# Altium project RS485_GPIO.PrjPcb (part 1 of 2)
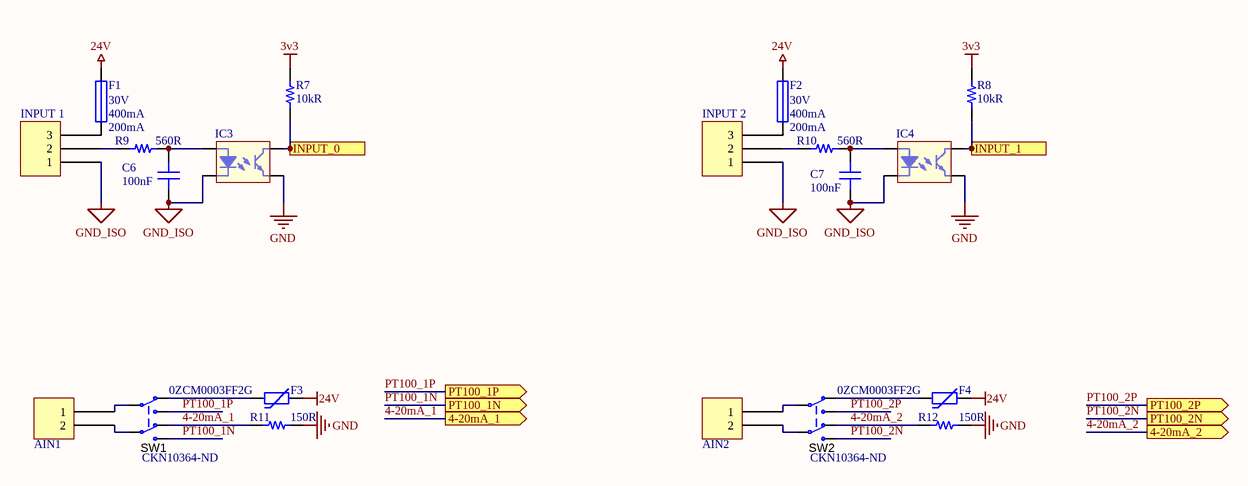
[diagram p0: Inputs.SchDoc]
4 sheets, 77 parts. Net scope: flat (ports and power ports of the same name join across sheets).
Board file: RS485_GPIO.PcbDoc
Sheets:
  Inputs.SchDoc
  Outputs.SchDoc
  4-20mA.SchDoc
  PT100.SchDoc

## Sheet Inputs.SchDoc: Isolated Input
size A4; Revision: 1; SheetNumber: 3; SheetTotal: 7; SheetSize: A4

### Parts
AIN1  2 Pin  [TE 282834-2]  (value not drawn)
AIN2  2 Pin  [TE 282834-2]  (value not drawn)
C6  100nF  [CAP 0603/1608]
C7  100nF  [CAP 0603/1608]
F1  Hold Current: 200mA  Max Voltage Rating (DC): 30V  Trip Current: 400mA  [L_1812]  (hidden comment: 0ZCJ0020FF2E)
F2  Hold Current: 200mA  Max Voltage Rating (DC): 30V  Trip Current: 400mA  [L_1812]  (hidden comment: 0ZCJ0020FF2E)
F3  0ZCM0003FF2G  [NTC 0603_1608]
F4  0ZCM0003FF2G  [NTC 0603_1608]
IC3  EL3H7(B)(TA)-VG  [EL3H7-VG]  (value not drawn)
IC4  EL3H7(B)(TA)-VG  [EL3H7-VG]  (value not drawn)
INPUT_1  (no value)  [TE 282834-3]
INPUT_2  (no value)  [TE 282834-3]
R7  10kR  [RES 0603/1608]
R8  10kR  [RES 0603/1608]
R9  560R  [RES 0603/1608]
R10  560R  [RES 0603/1608]
R11  150R  [RES 0603/1608]
R12  150R  [RES 0603/1608]
SW1  Supplier Part Number 1: CKN10364-ND  [SK-22D01-MG 5 NS]  (hidden comment: SK22D01MG5NS)
SW2  Supplier Part Number 1: CKN10364-ND  [SK-22D01-MG 5 NS]  (hidden comment: SK22D01MG5NS)

### Ports
4-20mA_1 (out), 4-20mA_2 (out), INPUT_0 (out), INPUT_1 (out), PT100_1N (out), PT100_1P (out), PT100_2N (out), PT100_2P (out)

### Nets
3v3: R7.2 R8.2
24V: F1.2 F2.2 F3.2 F4.2
GND: IC3.3 IC4.3 R11.2 R12.2
GND_ISO: C6.1 C7.1 IC3.2 IC4.2 INPUT_1.1 INPUT_2.1
4-20mA_1: R11.1 SW1.3 ; port 4-20mA_1
4-20mA_2: R12.1 SW2.3 ; port 4-20mA_2
PT100_1N: SW1.1 ; port PT100_1N
PT100_1P: SW1.4 ; port PT100_1P
PT100_2N: SW2.1 ; port PT100_2N
PT100_2P: SW2.4 ; port PT100_2P
NetAIN1_1: AIN1.1 SW1.5
NetAIN1_2: AIN1.2 SW1.2
NetAIN2_1: AIN2.1 SW2.5
NetAIN2_2: AIN2.2 SW2.2
NetC6_2: C6.2 IC3.1 R9.2
NetC7_2: C7.2 IC4.1 R10.2
NetF1_1: F1.1 INPUT_1.3
NetF2_1: F2.1 INPUT_2.3
NetF3_1: F3.1 SW1.6
NetF4_1: F4.1 SW2.6
NetIC3_4: IC3.4 R7.1 ; port INPUT_0
NetIC4_4: IC4.4 R8.1 ; port INPUT_1
NetINPUT_1_2: INPUT_1.2 R9.1
NetINPUT_2_2: INPUT_2.2 R10.1

### Notes on the sheet
- Title:
- Size:
- Project:
- Revision:
- Sheet
- of
- Date:
- YıLDıZ IoT
- Elperek Mahallesi
- Saray Sokak, No:12
- SAKARYA / TURKEY
- File:

### Library data of the parts
AIN1 AIN2 = 2 Pin: Manufacturer: TE Connectivity; Manufacturer Part Number: 282834-2; Plating: Brass,Steel; Max Supply Voltage (AC): 150V; Number of Contacts: 2; Closed End: No (Without); Max Current Rating: 10A; Connector Type: Receptacle; Screwless Terminal Block: Yes (With); Gender: Male; Number of Levels: 1; Tail Length: 3.4mm; Wire Gauge (Max): 30AWG; Pitch: 2.54mm; Thread Size: M1.6; Approvals: UL; Supplier 1: Digi-Key; Supplier Part Number 1: A98333-ND; Stock 1: 19973; Pricing 1: 1 = 0,89000, 10 = 0,62600, 25 = 0,58360, 50 = 0,52980, 100 = 0,52740, 250 = 0,44536, 500 = 0,42192, 1000 = 0,37504, 5000 = 0,35160 (USD); RoHS: Yes; Mount: Through Hole; Material: Nylon; Housing Color: Green; Contact Plating: Tin; Contact Material: Brass; Color: Green; Housing Material: Polyamide; Min Operating Temperature: -40°C; Max Operating Temperature: 105°C; Number of Circuits: 2; Interlock: No (Without); Screw Flange: No (Without); Side Stackable: Yes (With); Orientation: Straight; Number of Rows: 1; Max Voltage Rating (AC): 150V; Number of Poles: 2; Current Rating: 10A; Voltage Rating: 150V; Package Quantity: 300; Packaging: Bulk; Number of Positions: 2; Termination: Solder; Number of Positions Per Level: 2; Current: 10A; Voltage: 150V; Length: 5.54mm; Depth: 6.5mm; Wire Gauge (Min): 30AWG; Width: 6.5mm; Wire/Cable Gauge: 30AWG; Radiation Hardening: No; ELV: Compliant; Lead Free: Lead Free; REACH SVHC: Unknown; Flammability Rating: UL94 V-0; ComponentLink1URL: https://datasheet.ciiva.com/11758/0900766b80e7dc96-11758675.pdf?src-supplier=RSComponents; ComponentLink1Description: https://datasheet.ciiva.com/11758/0900766b80e7dc96-11758675.pdf?src-supplier=RSComponents; ComponentLink2URL: https://datasheet.ciiva.com/16386/282834-2-16386363.pdf?src-supplier=Future+Electronics; ComponentLink2Description: https://datasheet.ciiva.com/16386/282834-2-16386363.pdf?src-supplier=Future+Electronics; ComponentLink3URL: https://datasheet.ciiva.com/14609/70086732-14609670.pdf?src-supplier=Allied+Electronics; ComponentLink3Description: https://datasheet.ciiva.com/14609/70086732-14609670.pdf?src-supplier=Allied+Electronics; ComponentLink4URL: https://datasheet.ciiva.com/15169/getdatasheetpartid-155864-15169558.pdf?src-supplier=Verical; ComponentLink4Description: https://datasheet.ciiva.com/15169/getdatasheetpartid-155864-15169558.pdf?src-supplier=Verical; ComponentLink5URL: https://datasheet.ciiva.com/3141/eng-cs-1308389-eurostyle-terminal-blocks-0607-3141115.pdf?src-supplier=Avnet; ComponentLink5Description: https://datasheet.ciiva.com/3141/eng-cs-1308389-eurostyle-terminal-blocks-0607-3141115.pdf?src-supplier=Avnet; ComponentLink6URL: https://datasheet.ciiva.com/823/eng-cd-282834-c1-823453.pdf?src-supplier=Digi-Key; ComponentLink6Description: https://datasheet.ciiva.com/823/eng-cd-282834-c1-823453.pdf?src-supplier=Digi-Key; ComponentLink7URL: https://datasheet.ciiva.com/16676/eng-cs-1308389-eurostyle-terminal-blocks-0607-16676126.pdf?src-supplier=Avnet+Europe; ComponentLink7Description: https://datasheet.ciiva.com/16676/eng-cs-1308389-eurostyle-terminal-blocks-0607-16676126.pdf?src-supplier=Avnet+Europe; ComponentLink8URL: https://datasheet.ciiva.com/30166/eng-cs-1308389-eurostyle-terminal-blocks-0607-30166974.pdf?src-supplier=Onlinecomponents.com; ComponentLink8Description: https://datasheet.ciiva.com/30166/eng-cs-1308389-eurostyle-terminal-blocks-0607-30166974.pdf?src-supplier=Onlinecomponents.com
C6 C7 = Capacitor - Ceramic: Ceramic, SMT Capacitor; Manufacturer: Samsung; Manufacturer Part Number: CL10B104JB8NNNC; Tolerance: 5%; Voltage Rating: 50V; Dielectric: X7R; Supplier 1: Digi-Key; Supplier Part Number 1: 1276-1033-1-ND; Stock 1: 223594; Pricing 1: 1 = 0,10000, 10 = 0,05300, 100 = 0,02350, 500 = 0,01680, 1000 = 0,01320 (USD); RoHS: Yes; Mount: Surface Mount; Case/Package: 0603; Case Code (Metric): 1608; Case Code (Imperial): 0603; Material: Ceramic; Contact Plating: Tin; Min Operating Temperature: -55°C; Max Operating Temperature: 125°C; Packaging: Tape and Reel; Package Quantity: 1; Capacitance: 100nF; Voltage: 50V; Length: 1.6mm; Height: 0.8mm; Width: 0.031inch; Thickness: 0.035inch; Depth: 0.8mm; Radiation Hardening: No; ComponentLink1URL: https://media.digikey.com/pdf/Data%20Sheets/Samsung%20PDFs/CL_Series_MLCC_ds.pdf?src-supplier=Digi-Key; ComponentLink1Description: https://media.digikey.com/pdf/Data%20Sheets/Samsung%20PDFs/CL_Series_MLCC_ds.pdf?src-supplier=Digi-Key; ComponentLink2URL: https://www.verical.com/server-webapp/html/getDatasheet?partID=359321&src-supplier=Verical; ComponentLink2Description: https://www.verical.com/server-webapp/html/getDatasheet?partID=359321&src-supplier=Verical; ComponentLink3URL: http://www1.futureelectronics.com/doc/SAMSUNG/CL10B104JB8NNNC.pdf?src-supplier=Future+Electronics; ComponentLink3Description: http://www1.futureelectronics.com/doc/SAMSUNG/CL10B104JB8NNNC.pdf?src-supplier=Future+Electronics; ComponentLink4URL: https://produktinfo.conrad.com/datenblaetter/450000-474999/456613-da-01-en-VS_KONDENSATOR_0603.pdf?src-supplier=Conrad; ComponentLink4Description: https://produktinfo.conrad.com/datenblaetter/450000-474999/456613-da-01-en-VS_KONDENSATOR_0603.pdf?src-supplier=Conrad
F1 F2 = Fuse 1: Fuse; Manufacturer: Bel; Max Current Rating: 10A; Power Dissipation: 400mW; Time to Trip: 0.1s; Approvals: TUV,UL; ComponentLink2Description: SMD; ComponentLink3Description: ESIMF110/16-2; Supplier 1: Digi-Key; Supplier Part Number 1: 507-1797-1-ND; Manufacturer Part Number: 0ZCJ0020FF2E; Stock 1: 381173; Pricing 1: 1 = 0,13000, 5 = 0,13000, 10 = 0,12500, 50 = 0,11140, 100 = 0,10370, 250 = 0,09216, 500 = 0,07680, 1000 = 0,07296 (USD); RoHS: Yes; Mount: Surface Mount; Case/Package: 1206; Case Code (Metric): 3216; Case Code (Imperial): 1206; Contact Plating: Matte,Tin; Number of Terminals: 2; Min Operating Temperature: -40°C; Max Operating Temperature: 85°C; Package Quantity: 3000; Packaging: Cut Tape; Lead Free: Lead Free; ComponentLink1URL: https://www.belfuse.com/resources/CircuitProtection/datasheets/0ZCJ%20Nov2016.pdf; ComponentLink1Description: https://www.belfuse.com/resources/CircuitProtection/datasheets/0ZCJ%20Nov2016.pdf; Price: 0,13
F3 F4 = ERT-J1VK102JM: THERM NTC 0603 (FOR AUTOMOTIVE); Manufacturer: Bel; ComponentLink1Description: Datasheet; ComponentLink1URL: https://industrial.panasonic.com/cdbs/www-data/pdf/AUA0000/AUA0000C11.pdf; ComponentLink2Description: DigiKey Link; ComponentLink2URL: http://digikey.com/product-detail/en/panasonic-electronic-components/ERT-J1VK102JM/P123690DKR-ND/9351505; Supplier 1: Digi-Key; Supplier Part Number 1: 507-0ZCM0003FF2GCT-ND; Manufacturer Part Number: 0ZCM0003FF2G; Stock 1: 12; Pricing 1: 1 = 0,16000, 5 = 0,16000, 10 = 0,15200, 50 = 0,13580, 100 = 0,12640, 250 = 0,11232, 500 = 0,09360, 1000 = 0,08892 (USD); RoHS: No
IC3 IC4 = Optoisolator: Manufacturer: Everlight; Number of Channels: 1; Collector Emitter Voltage (VCEO): 80V; Max Power Dissipation: 200mW; Forward Current: 50mA; Forward Voltage: 1.4V; Reverse Breakdown Voltage: 6V; Rise Time: 18000ns; Collector Emitter Saturation Voltage: 200mV; Isolation Voltage: 3.75kV; Current Transfer Ratio: 260%; Approvals: UL; Supplier 1: Digi-Key; Supplier Part Number 1: 1080-1197-1-ND; Manufacturer Part Number: EL3H7(B)(TA)-VG; Stock 1: 29823; Pricing 1: 1 = 0,50000, 10 = 0,35500, 100 = 0,20730, 500 = 0,14212, 1000 = 0,11844, 2500 = 0,10660 (USD); RoHS: Yes; Mount: Surface Mount; Case/Package: SSOP; Number of Pins: 4; Min Operating Temperature: -55°C; Max Operating Temperature: 125°C; Packaging: Tape and Reel; Package Quantity: 1; Max Output Voltage: 80V; Output Current per Channel: 50mA; Max Input Current: 50mA; Max Collector Current: 50mA; Fall Time: 18000ns; Number of Elements: 1; Power Dissipation: 200mW; Collector Emitter Breakdown Voltage: 80V; Radiation Hardening: No; Lead Free: Lead Free; ComponentLink1URL: https://datasheet.ciiva.com/2086/el3h7-g-series-2086501.pdf?src-supplier=Digi-Key; ComponentLink1Description: https://datasheet.ciiva.com/2086/el3h7-g-series-2086501.pdf?src-supplier=Digi-Key; ComponentLink2URL: https://datasheet.ciiva.com/2086/el3h7-g-series-2086502.pdf?src-supplier=Digi-Key; ComponentLink2Description: https://datasheet.ciiva.com/2086/el3h7-g-series-2086502.pdf?src-supplier=Digi-Key; ComponentLink3URL: https://datasheet.ciiva.com/2086/el3h7-g-series-2086503.pdf?src-supplier=Digi-Key; ComponentLink3Description: https://datasheet.ciiva.com/2086/el3h7-g-series-2086503.pdf?src-supplier=Digi-Key; ComponentLink4URL: https://datasheet.ciiva.com/15209/getdatasheetpartid-416716-15209115.pdf?src-supplier=Verical; ComponentLink4Description: https://datasheet.ciiva.com/15209/getdatasheetpartid-416716-15209115.pdf?src-supplier=Verical
INPUT_1 INPUT_2 = 3 Pin: TERM BLOCK HDR 3POS R/A 3.81MM; Manufacturer: On-Shore Technology; Manufacturer Part Number: OSTVN03A150; Plating: Brass,Steel; Number of Levels: 1; Number of Positions Per Level: 3; Current: 6A; Voltage: 125V; Pitch: 0.1inch; Wire Gauge (Max): 30AWG; Wire Gauge (Min): 20AWG; ComponentLink1Description: Datasheet; ComponentLink1URL: http://portal.fciconnect.com/Comergent//fci/drawing/20020110.pdf; ComponentLink2Description: Digi-Key Listing; ComponentLink2URL: http://www.digikey.ca/product-detail/en/20020110-D031A01LF/609-3820-ND/2261261; Supplier 1: Digi-Key; Supplier Part Number 1: ED10562-ND; Stock 1: 6258; Pricing 1: 1 = 1,03000, 10 = 0,72600, 25 = 0,67720, 50 = 0,61480, 100 = 0,61200, 250 = 0,51680, 500 = 0,48960, 1000 = 0,43520, 5000 = 0,35360 (USD); RoHS: Yes; Mount: Through Hole; Number of Pins: 3; Housing Material: Thermoplastic; Color: Green; Contact Plating: Brass; Min Operating Temperature: -30°C; Max Operating Temperature: 105°C; Termination: Screw; Packaging: Bulk; ComponentLink3URL: https://datasheet.ciiva.com/825/ostvnxxa150-825196.pdf?src-supplier=Digi-Key; ComponentLink3Description: https://datasheet.ciiva.com/825/ostvnxxa150-825196.pdf?src-supplier=Digi-Key
R7 R8 = Resistor_Chip: Ceramic, SMT Capacitor; Manufacturer: Stackpole Electronics; Manufacturer Part Number: RNCP0603FTD10K0; Tolerance: 1%; Max Power Dissipation: 125mW; Temperature Coefficient: 100ppm/°C; Supplier 1: Digi-Key; Supplier Part Number 1: RNCP0603FTD10K0CT-ND; Stock 1: 183083; Pricing 1: 1 = 0,10000, 10 = 0,06700, 100 = 0,02730, 1000 = 0,01224, 2500 = 0,01063 (USD); RoHS: Yes; Mount: Surface Mount; Case/Package: 0603; Case Code (Metric): 1608; Case Code (Imperial): 0603; Contact Plating: Matte,Tin; Min Operating Temperature: -55°C; Max Operating Temperature: 155°C; Packaging: Tape and Reel; Resistance: 10kR; Composition: Thin Film; Number of Terminations: 2; Features: Anti-Sulfur,Moisture Resistant; Length: 0.059inch; Height: 0.02inch; Width: 0.031inch; Radiation Hardening: No; Lead Free: Lead Free
R9 R10 = Resistor_Chip: Ceramic, SMT Capacitor; Manufacturer: Rohm; Manufacturer Part Number: ESR03EZPJ561; Tolerance: 5%; Temperature Coefficient: 200ppm/°C; Max Power Dissipation: 250mW; Supplier 1: Digi-Key; Supplier Part Number 1: RHM560DCT-ND; Stock 1: 14494; Pricing 1: 1 = 0,10000, 10 = 0,08700, 100 = 0,03330, 1000 = 0,01464, 2500 = 0,01264 (USD); RoHS: Yes; Case/Package: 0603; Case Code (Metric): 1608; Case Code (Imperial): 0603; Min Operating Temperature: -55°C; Max Operating Temperature: 155°C; Package Quantity: 1; Resistance: 560R; Packaging: Tape and Reel; Composition: Thick Film; Number of Terminations: 2; Features: Automotive AEC-Q200; Length: 0.063inch; Height: 0.022inch; Width: 0.031inch; ComponentLink1URL: http://www.rohm.com/web/global/datasheet/ESR01MZPF/esr-e; ComponentLink1Description: http://www.rohm.com/web/global/datasheet/ESR01MZPF/esr-e; ComponentLink2URL: https://www.rohm.com/datasheet/ESR01MZPF/esr-e; ComponentLink2Description: https://www.rohm.com/datasheet/ESR01MZPF/esr-e
R11 R12 = Resistor_Chip: Ceramic, SMT Capacitor; Manufacturer: Yageo; Manufacturer Part Number: RC0603FR-07150RL; Temperature Coefficient: 100ppm/°C; Tolerance: 1%; Voltage Rating (DC): 50V; Power Rating: 100mW; Supplier 1: Digi-Key; Supplier Part Number 1: 311-150HRCT-ND; Stock 1: 2591507; Pricing 1: 1 = 0,10000, 10 = 0,02300, 100 = 0,00940, 1000 = 0,00421, 2500 = 0,00366 (USD); RoHS: Yes; Case/Package: 0603; Number of Pins: 2; Case Code (Imperial): 0603; Case Code (Metric): 1608; Min Operating Temperature: -55°C; Max Operating Temperature: 155°C; Resistance: 150R; Packaging: Tape and Reel; Composition: Thick Film; Termination: SMD/SMT; Military Standard: Not; Voltage Rating: 50V; Package Quantity: 5000; Length: 1.6mm; Height: 0.45mm; Width: 0.8mm; Depth: 0.8mm; Lead Free: Lead Free; REACH SVHC: No SVHC; ComponentLink1URL: https://datasheet.ciiva.com/46440/1868787-46440893.pdf?src-supplier=Element14; ComponentLink1Description: https://datasheet.ciiva.com/46440/1868787-46440893.pdf?src-supplier=Element14; ComponentLink2URL: https://datasheet.ciiva.com/12555/rc0603-272842-12555301.pdf?src-supplier=Mouser; ComponentLink2Description: https://datasheet.ciiva.com/12555/rc0603-272842-12555301.pdf?src-supplier=Mouser; ComponentLink3URL: https://datasheet.ciiva.com/46412/443971-46412844.pdf?src-supplier=Element14; ComponentLink3Description: https://datasheet.ciiva.com/46412/443971-46412844.pdf?src-supplier=Element14
SW1 SW2 = DPDT Switch: Switch THD right-angle toggle DPDT; Manufacturer: ITT C&K; Actuator Material: PBT,Polybutylene; Actuator Type: Standard; Electrical Life: 10000Cycles; Illumination Type: Non-Illuminated; Current Rating: 300mA; Voltage Rating (DC): 30V; Switch Travel: 2mm; Switch Function: On-On; Actuator Length: 5mm; Supplier 1: Digi-Key; Manufacturer Part Number: SK22D01MG5NS; Stock 1: 4200; Pricing 1: 1 = 0,69000, 10 = 0,66900, 25 = 0,64320, 100 = 0,55820, 250 = 0,50936, 500 = 0,47334, 1000 = 0,42446, 2500 = 0,39874, 5000 = 0,37044 (USD); RoHS: Yes; Mount: Through Hole; Contact Plating: Silver; Termination: PC Pin; Throw Configuration: DPDT; Package Quantity: 1000; Contact Current Rating: 300mA; Packaging: Bulk; ComponentLink1URL: https://datasheet.ciiva.com/5279/sk-22d01-mg-190328-5279988.pdf?src-supplier=Mouser; ComponentLink1Description: https://datasheet.ciiva.com/5279/sk-22d01-mg-190328-5279988.pdf?src-supplier=Mouser; ComponentLink2URL: https://datasheet.ciiva.com/2889/sk-22d01-mg-2889186.pdf?src-supplier=Digi-Key; ComponentLink2Description: https://datasheet.ciiva.com/2889/sk-22d01-mg-2889186.pdf?src-supplier=Digi-Key

## Sheet Outputs.SchDoc: Isolated Output
size A4; Revision: 1; SheetNumber: 4; SheetTotal: 7; SheetSize: A4
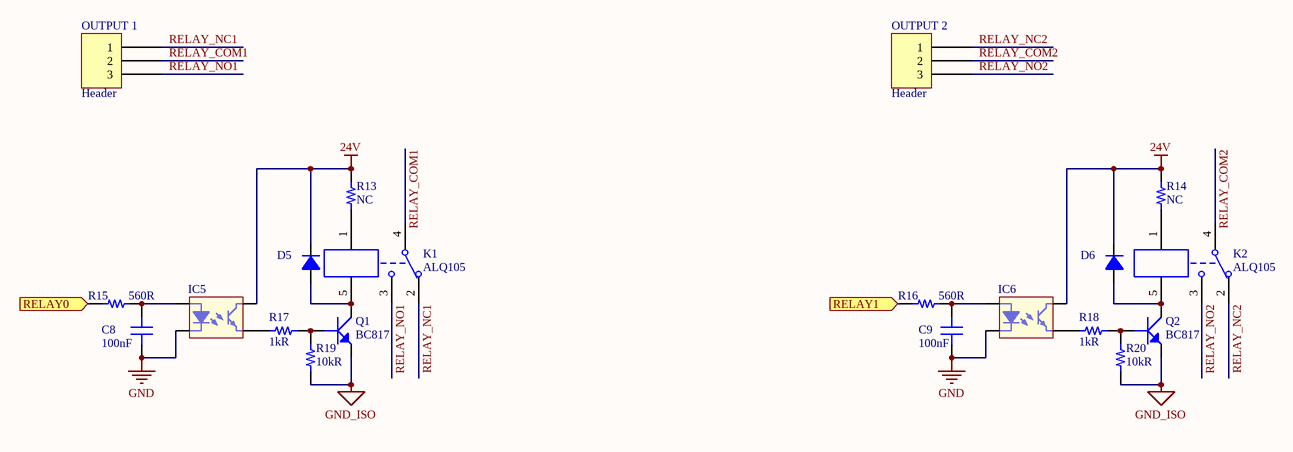
[diagram p1: Outputs.SchDoc]

### Parts
C8  100nF  [CAP 0603/1608]
C9  100nF  [CAP 0603/1608]
D5  1N4148WTR  [sod123]  (value not drawn)
D6  1N4148WTR  [sod123]  (value not drawn)
IC5  EL3H7(B)(TA)-VG  [EL3H7-VG]  (value not drawn)
IC6  EL3H7(B)(TA)-VG  [EL3H7-VG]  (value not drawn)
K1  ALQ105  [ALQ105]
K2  ALQ105  [ALQ105]
OUTPUT_1  Header  [TE 282834-3]
OUTPUT_2  Header  [TE 282834-3]
Q1  BC817  [SOT23-3]  (no BOM)
Q2  BC817  [SOT23-3]  (no BOM)
R13  NC  [RES 0603/1608]  (no BOM)
R14  NC  [RES 0603/1608]  (no BOM)
R15  560R  [RES 0603/1608]
R16  560R  [RES 0603/1608]
R17  1kR  [RES 0603/1608]
R18  1kR  [RES 0603/1608]
R19  10kR  [RES 0603/1608]
R20  10kR  [RES 0603/1608]

### Ports
RELAY0 (in), RELAY1 (in)

### Nets
24V: D5.2 D6.2 IC5.4 IC6.4 R13.2 R14.2
GND: C8.1 C9.1 IC5.2 IC6.2
GND_ISO: Q1.2(E) Q2.2(E) R19.2 R20.2
RELAY_COM1: K1.4(COM) OUTPUT_1.2
RELAY_COM2: K2.4(COM) OUTPUT_2.2
RELAY_NC1: K1.2(NC) OUTPUT_1.1
RELAY_NC2: K2.2(NC) OUTPUT_2.1
RELAY_NO1: K1.3(NO) OUTPUT_1.3
RELAY_NO2: K2.3(NO) OUTPUT_2.3
NetC8_2: C8.2 IC5.1 R15.2
NetC9_2: C9.2 IC6.1 R16.2
NetD5_1: D5.1 K1.5(COIL) Q1.3(C)
NetD6_1: D6.1 K2.5(COIL) Q2.3(C)
NetIC5_3: IC5.3 R17.2
NetIC6_3: IC6.3 R18.2
NetK1_1: K1.1(COIL) R13.1
NetK2_1: K2.1(COIL) R14.1
NetQ1_1: Q1.1(B) R17.1 R19.1
NetQ2_1: Q2.1(B) R18.1 R20.1
NetR15_1: R15.1 ; port RELAY0
NetR16_1: R16.1 ; port RELAY1

### Notes on the sheet
- Title:
- Size:
- Project:
- Revision:
- Sheet
- of
- Date:
- YıLDıZ IoT
- Elperek Mahallesi
- Saray Sokak, No:12
- SAKARYA / TURKEY
- File:

### Library data of the parts
C8 C9 = Capacitor - Ceramic: as C6 on sheet Inputs; Supplier 1: Digi-Key; Supplier Part Number 1: 1276-1033-1-ND; Stock 1: 223594; Pricing 1: 1 = 0,10000, 10 = 0,05300, 100 = 0,02350, 500 = 0,01680, 1000 = 0,01320 (USD); RoHS: Yes; Mount: Surface Mount; Case/Package: 0603; Case Code (Metric): 1608; Case Code (Imperial): 0603; Material: Ceramic; Contact Plating: Tin; Min Operating Temperature: -55°C; Max Operating Temperature: 125°C; Packaging: Tape and Reel; Package Quantity: 1; Capacitance: 100nF; Voltage: 50V; Length: 1.6mm; Height: 0.8mm; Width: 0.031inch; Thickness: 0.035inch; Depth: 0.8mm; Radiation Hardening: No; ComponentLink1URL: https://media.digikey.com/pdf/Data%20Sheets/Samsung%20PDFs/CL_Series_MLCC_ds.pdf?src-supplier=Digi-Key; ComponentLink1Description: https://media.digikey.com/pdf/Data%20Sheets/Samsung%20PDFs/CL_Series_MLCC_ds.pdf?src-supplier=Digi-Key; ComponentLink2URL: https://www.verical.com/server-webapp/html/getDatasheet?partID=359321&src-supplier=Verical; ComponentLink2Description: https://www.verical.com/server-webapp/html/getDatasheet?partID=359321&src-supplier=Verical; ComponentLink3URL: http://www1.futureelectronics.com/doc/SAMSUNG/CL10B104JB8NNNC.pdf?src-supplier=Future+Electronics; ComponentLink3Description: http://www1.futureelectronics.com/doc/SAMSUNG/CL10B104JB8NNNC.pdf?src-supplier=Future+Electronics; ComponentLink4URL: https://produktinfo.conrad.com/datenblaetter/450000-474999/456613-da-01-en-VS_KONDENSATOR_0603.pdf?src-supplier=Conrad; ComponentLink4Description: https://produktinfo.conrad.com/datenblaetter/450000-474999/456613-da-01-en-VS_KONDENSATOR_0603.pdf?src-supplier=Conrad
D5 D6 = Diode: Manufacturer: SMC; Max Reverse Voltage (DC): 75V; Average Rectified Current: 250mA; Reverse Recovery Time: 4ns; ComponentLink1URL: http://www.smc-diodes.com/propdf/1N4148W%20N0571%20REV.D.pdf?src-supplier=Digi-Key; ComponentLink1Description: http://www.smc-diodes.com/propdf/1N4148W%20N0571%20REV.D.pdf?src-supplier=Digi-Key; Supplier 1: Digi-Key; Supplier Part Number 1: 1655-1360-1-ND; Manufacturer Part Number: 1N4148WTR; Stock 1: 8882; Pricing 1: 1 = 0,12000, 10 = 0,11300, 25 = 0,10720, 100 = 0,04710, 250 = 0,04524, 500 = 0,03702, 1000 = 0,02571 (USD); RoHS: No; Mount: Surface Mount; Packaging: Tape and Reel
IC5 IC6 = Optoisolator: as IC3 on sheet Inputs; Supplier 1: Digi-Key; Supplier Part Number 1: 1080-1197-1-ND; Manufacturer Part Number: EL3H7(B)(TA)-VG; Stock 1: 29823; Pricing 1: 1 = 0,50000, 10 = 0,35500, 100 = 0,20730, 500 = 0,14212, 1000 = 0,11844, 2500 = 0,10660 (USD); RoHS: Yes; Mount: Surface Mount; Case/Package: SSOP; Number of Pins: 4; Min Operating Temperature: -55°C; Max Operating Temperature: 125°C; Packaging: Tape and Reel; Package Quantity: 1; Max Output Voltage: 80V; Output Current per Channel: 50mA; Max Input Current: 50mA; Max Collector Current: 50mA; Fall Time: 18000ns; Number of Elements: 1; Power Dissipation: 200mW; Collector Emitter Breakdown Voltage: 80V; Radiation Hardening: No; Lead Free: Lead Free; ComponentLink1URL: https://datasheet.ciiva.com/2086/el3h7-g-series-2086501.pdf?src-supplier=Digi-Key; ComponentLink1Description: https://datasheet.ciiva.com/2086/el3h7-g-series-2086501.pdf?src-supplier=Digi-Key; ComponentLink2URL: https://datasheet.ciiva.com/2086/el3h7-g-series-2086502.pdf?src-supplier=Digi-Key; ComponentLink2Description: https://datasheet.ciiva.com/2086/el3h7-g-series-2086502.pdf?src-supplier=Digi-Key; ComponentLink3URL: https://datasheet.ciiva.com/2086/el3h7-g-series-2086503.pdf?src-supplier=Digi-Key; ComponentLink3Description: https://datasheet.ciiva.com/2086/el3h7-g-series-2086503.pdf?src-supplier=Digi-Key; ComponentLink4URL: https://datasheet.ciiva.com/15209/getdatasheetpartid-416716-15209115.pdf?src-supplier=Verical; ComponentLink4Description: https://datasheet.ciiva.com/15209/getdatasheetpartid-416716-15209115.pdf?src-supplier=Verical
K1 K2 = Relay SPDT: Relay or Contactor; Manufacturer: Panasonic; Coil Voltage (DC): 5V; Coil Type: Non-Latching; Relay Type: General Purpose; Throw Configuration: SPDT; Coil Resistance: 62.5R; Coil Current: 80mA; Operate Time: 20ms; Coil Power: 400mW; Max Voltage Rating (AC): 250V; Contact Current Rating: 10A; Supplier 1: Digi-Key; Supplier Part Number 1: 255-3565-ND; Manufacturer Part Number: ALQ105; Stock 1: 8117; Pricing 1: 1 = 1,22000, 10 = 1,14800, 25 = 1,02000, 50 = 0,96900, 100 = 0,91800, 250 = 0,81600, 500 = 0,76500, 1000 = 0,71400, 5000 = 0,68850 (USD); RoHS: Yes; Number of Pins: 5; Weight: 7g; Contact Material: Silver; Min Operating Temperature: -40°C; Max Operating Temperature: 85°C; Termination: PC Pin; Release Time: 20ms; Package Quantity: 100; Packaging: Carton; Power Rating: 400mW; Power Consumption: 400mW; Voltage Rating (AC): 250V; Length: 20mm; Height: 16mm; Depth: 10mm; Width: 10mm; Lead Free: Lead Free; REACH SVHC: Unknown; ComponentLink1URL: http://www.mouser.com/ds/2/315/lq-catalog-1075796.pdf?src-supplier=Mouser; ComponentLink1Description: http://www.mouser.com/ds/2/315/lq-catalog-1075796.pdf?src-supplier=Mouser; ComponentLink2URL: http://www.farnell.com/datasheets/2245159.pdf?src-supplier=Farnell; ComponentLink2Description: http://www.farnell.com/datasheets/2245159.pdf?src-supplier=Farnell; ComponentLink3URL: http://components.arrow.com/part/dataview/0323_06571492?src-supplier=Arrow+Europe; ComponentLink3Description: http://components.arrow.com/part/dataview/0323_06571492?src-supplier=Arrow+Europe; ComponentLink4URL: http://www.alliedelec.com/m/d/b3e6213128df2023f710f2e9cac83292.pdf?src-supplier=Allied+Electronics; ComponentLink4Description: http://www.alliedelec.com/m/d/b3e6213128df2023f710f2e9cac83292.pdf?src-supplier=Allied+Electronics; ComponentLink5URL: https://media.digikey.com/pdf/Data%20Sheets/Panasonic%20Electric%20Works%20PDFs/ALQ(LQ)Relays_NewProdIntro.pdf?src-supplier=Digi-Key; ComponentLink5Description: https://media.digikey.com/pdf/Data%20Sheets/Panasonic%20Electric%20Works%20PDFs/ALQ(LQ)Relays_NewProdIntro.pdf?src-supplier=Digi-Key; ComponentLink6URL: http://www.farnell.com/datasheets/1972641.pdf?src-supplier=Element14; ComponentLink6Description: http://www.farnell.com/datasheets/1972641.pdf?src-supplier=Element14; ComponentLink7URL: http://www.farnell.com/datasheets/2245159.pdf?src-supplier=Newark; ComponentLink7Description: http://www.farnell.com/datasheets/2245159.pdf?src-supplier=Newark
OUTPUT_1 OUTPUT_2 = 3 Pin: Manufacturer: On-Shore Technology; Manufacturer Part Number: OSTVN03A150; Plating: Brass,Steel; Number of Levels: 1; Number of Positions Per Level: 3; Current: 6A; Voltage: 125V; Pitch: 0.1inch; Wire Gauge (Max): 30AWG; Wire Gauge (Min): 20AWG; Supplier 1: Digi-Key; Supplier Part Number 1: ED10562-ND; Stock 1: 6258; Pricing 1: 1 = 1,03000, 10 = 0,72600, 25 = 0,67720, 50 = 0,61480, 100 = 0,61200, 250 = 0,51680, 500 = 0,48960, 1000 = 0,43520, 5000 = 0,35360 (USD); RoHS: Yes; Mount: Through Hole; Number of Pins: 3; Housing Material: Thermoplastic; Color: Green; Contact Plating: Brass; Min Operating Temperature: -30°C; Max Operating Temperature: 105°C; Termination: Screw; Packaging: Bulk; ComponentLink1URL: https://datasheet.ciiva.com/825/ostvnxxa150-825196.pdf?src-supplier=Digi-Key; ComponentLink1Description: https://datasheet.ciiva.com/825/ostvnxxa150-825196.pdf?src-supplier=Digi-Key
Q1 Q2 = BC817: Transistor, BC817; Manufacturer: ON Semiconductor; Manufacturer Part Number: BC817-16LT1G; Transistor Type: NPN; Vce Saturation (Max) @ Ib, Ic: 700mV @ 50mA, 500mA; Current - Collector Cutoff (Max): 100nA (ICBO); DC Current Gain (hFE) (Min) @ Ic, Vce: 100 @ 100mA, 1V; Frequency - Transition: 100MHz; Supplier 1: Digi-Key; Supplier Part Number 1: BC817-16LT1GOSCT-ND; RoHS: RoHS Compliant; Category: Discrete Semiconductor Products; Stock 1: 46603; Pricing 1: 1=0.13, 10=0.118, 100=0.0642, 500=0.0395, 1000=0.02693 (USD); Packaging: Cut Tape (CT); Part Status: Active; Operating Temperature: -65°C ~ 150°C (TJ); Mounting Type: Surface Mount; Package / Case: TO-236-3, SC-59, SOT-23-3; Supplier Device Package: SOT-23-3 (TO-236); Base Part Number: BC817; ComponentLink1URL: http://www.onsemi.com/pub/Collateral/BC817-16LT1-D.PDF; ComponentLink1Description: http://www.onsemi.com/pub/Collateral/BC817-16LT1-D.PDF; Price: 0,13
R13 R14 = Resistor_Chip: Ceramic, SMT Capacitor; Resistance: NC
R15 R16 = Resistor_Chip: as R9 on sheet Inputs; Supplier 1: Digi-Key; Supplier Part Number 1: RHM560DCT-ND; Stock 1: 14494; Pricing 1: 1 = 0,10000, 10 = 0,08700, 100 = 0,03330, 1000 = 0,01464, 2500 = 0,01264 (USD); RoHS: Yes; Case/Package: 0603; Case Code (Metric): 1608; Case Code (Imperial): 0603; Min Operating Temperature: -55°C; Max Operating Temperature: 155°C; Package Quantity: 1; Resistance: 560R; Packaging: Tape and Reel; Composition: Thick Film; Number of Terminations: 2; Features: Automotive AEC-Q200; Length: 0.063inch; Height: 0.022inch; Width: 0.031inch; ComponentLink1URL: http://www.rohm.com/web/global/datasheet/ESR01MZPF/esr-e; ComponentLink1Description: http://www.rohm.com/web/global/datasheet/ESR01MZPF/esr-e; ComponentLink2URL: https://www.rohm.com/datasheet/ESR01MZPF/esr-e; ComponentLink2Description: https://www.rohm.com/datasheet/ESR01MZPF/esr-e
R17 R18 = Resistor_Chip: Ceramic, SMT Capacitor; Manufacturer: Rohm; Manufacturer Part Number: ESR03EZPJ102; Tolerance: 5%; Temperature Coefficient: 200ppm/°C; Max Power Dissipation: 250mW; Supplier 1: Digi-Key; Supplier Part Number 1: RHM1.0KDCT-ND; Stock 1: 148117; Pricing 1: 1 = 0,10000, 10 = 0,08300, 100 = 0,03180, 1000 = 0,01398, 2500 = 0,01207 (USD); RoHS: Yes; Case/Package: 0603; Case Code (Metric): 1608; Case Code (Imperial): 0603; Min Operating Temperature: -55°C; Max Operating Temperature: 155°C; Resistance: 1kR; Package Quantity: 1; Packaging: Tape and Reel; Composition: Thick Film; Number of Terminations: 2; Features: Automotive AEC-Q200; Length: 0.063inch; Height: 0.022inch; Width: 0.031inch; Lead Free: Lead Free; ComponentLink1URL: https://datasheet.ciiva.com/2469/esr-2469603.pdf?src-supplier=Digi-Key; ComponentLink1Description: https://datasheet.ciiva.com/2469/esr-2469603.pdf?src-supplier=Digi-Key; ComponentLink2URL: https://datasheet.ciiva.com/2469/esr-2469604.pdf?src-supplier=Digi-Key; ComponentLink2Description: https://datasheet.ciiva.com/2469/esr-2469604.pdf?src-supplier=Digi-Key; ComponentLink3URL: https://datasheet.ciiva.com/2469/esr-2469605.pdf?src-supplier=Digi-Key; ComponentLink3Description: https://datasheet.ciiva.com/2469/esr-2469605.pdf?src-supplier=Digi-Key
R19 R20 = Resistor_Chip: as R7 on sheet Inputs; Supplier 1: Digi-Key; Supplier Part Number 1: RNCP0603FTD10K0CT-ND; Stock 1: 183083; Pricing 1: 1 = 0,10000, 10 = 0,06700, 100 = 0,02730, 1000 = 0,01224, 2500 = 0,01063 (USD); RoHS: Yes; Mount: Surface Mount; Case/Package: 0603; Case Code (Metric): 1608; Case Code (Imperial): 0603; Contact Plating: Matte,Tin; Min Operating Temperature: -55°C; Max Operating Temperature: 155°C; Packaging: Tape and Reel; Resistance: 10kR; Composition: Thin Film; Number of Terminations: 2; Features: Anti-Sulfur,Moisture Resistant; Length: 0.059inch; Height: 0.02inch; Width: 0.031inch; Radiation Hardening: No; Lead Free: Lead Free

## Sheet 4-20mA.SchDoc: Isolated 4-20mA
size A4; Revision: 1; SheetNumber: 5; SheetTotal: 7; SheetSize: A4
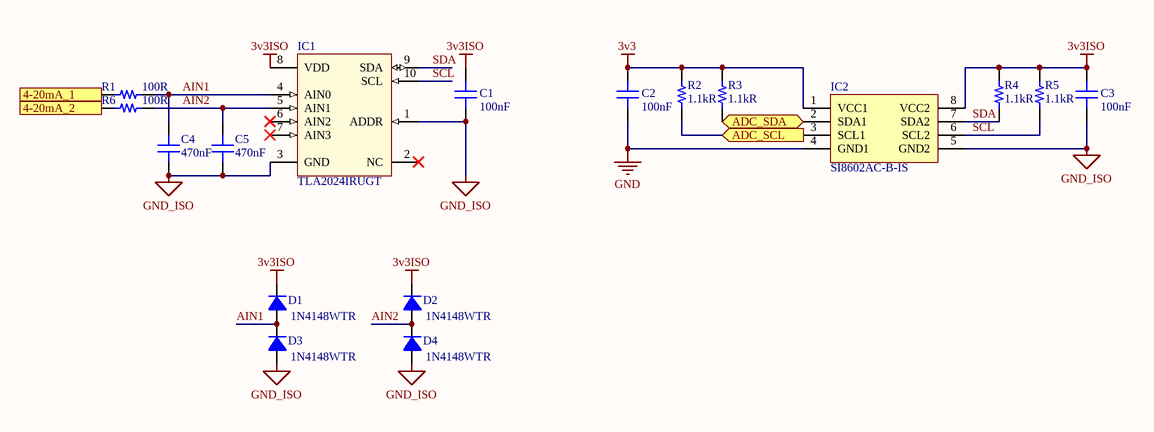
[diagram p2: 4-20mA.SchDoc]

### Parts
C1  100nF  [CAP 0603/1608]
C2  100nF  [CAP 0603/1608]
C3  100nF  [CAP 0603/1608]
C4  470nF  [CAP 0603/1608]
C5  470nF  [CAP 0603/1608]
D1  1N4148WTR  [sod123]
D2  1N4148WTR  [sod123]
D3  1N4148WTR  [sod123]
D4  1N4148WTR  [sod123]
IC1  TLA2024IRUGT  [TI X2QFN-10 2x1.5mm]
IC2  SI8602AC-B-IS  [MICROCHIP SOIC-8 208MIL WIDE]
R1  100R  [RES 0603/1608]
R2  1.1kR  [RES 0603/1608]
R3  1.1kR  [RES 0603/1608]
R4  1.1kR  [RES 0603/1608]
R5  1.1kR  [RES 0603/1608]
R6  100R  [RES 0603/1608]

### Ports
4-20mA_1 (in), 4-20mA_2 (in), ADC_SCL (in), ADC_SDA (bidir)

### Nets
3v3: C2.2 IC2.1(VCC1) R2.1 R3.1
3v3ISO: C1.2 C3.2 D1.2 D2.2 IC1.8(VDD) IC2.8(VCC2) R4.1 R5.1
GND: C2.1 IC2.4(GND1)
GND_ISO: C1.1 C3.1 C4.1 C5.1 D3.1 D4.1 IC1.1(ADDR) IC1.3(GND) IC2.5(GND2)
4-20mA_1: R1.1 ; port 4-20mA_1
4-20mA_2: R6.1 ; port 4-20mA_2
AIN1: C4.2 D1.1 D3.2 IC1.4(AIN0) R1.2
AIN2: C5.2 D2.1 D4.2 IC1.5(AIN1) R6.2
SCL: IC1.10(SCL) IC2.6(SCL2) R5.2
SDA: IC1.9(SDA) IC2.7(SDA2) R4.2
NetIC2_2: IC2.2(SDA1) R3.2 ; port ADC_SDA
NetIC2_3: IC2.3(SCL1) R2.2 ; port ADC_SCL

Not connected (* = marked no-connect by the designer): IC1 2(NC)* 6(AIN2)* 7(AIN3)*

### Notes on the sheet
- Title:
- Size:
- Project:
- Revision:
- Sheet
- of
- Date:
- YıLDıZ IoT
- Elperek Mahallesi
- Saray Sokak, No:12
- SAKARYA / TURKEY
- File:

### Library data of the parts
C1-C3 = Capacitor - Ceramic: as C6 on sheet Inputs; Supplier 1: Digi-Key; Supplier Part Number 1: 1276-1033-1-ND; Stock 1: 223594; Pricing 1: 1 = 0,10000, 10 = 0,05300, 100 = 0,02350, 500 = 0,01680, 1000 = 0,01320 (USD); RoHS: Yes; Mount: Surface Mount; Case/Package: 0603; Case Code (Metric): 1608; Case Code (Imperial): 0603; Material: Ceramic; Contact Plating: Tin; Min Operating Temperature: -55°C; Max Operating Temperature: 125°C; Packaging: Tape and Reel; Package Quantity: 1; Capacitance: 100nF; Voltage: 50V; Length: 1.6mm; Height: 0.8mm; Width: 0.031inch; Thickness: 0.035inch; Depth: 0.8mm; Radiation Hardening: No; ComponentLink1URL: https://media.digikey.com/pdf/Data%20Sheets/Samsung%20PDFs/CL_Series_MLCC_ds.pdf?src-supplier=Digi-Key; ComponentLink1Description: https://media.digikey.com/pdf/Data%20Sheets/Samsung%20PDFs/CL_Series_MLCC_ds.pdf?src-supplier=Digi-Key; ComponentLink2URL: https://www.verical.com/server-webapp/html/getDatasheet?partID=359321&src-supplier=Verical; ComponentLink2Description: https://www.verical.com/server-webapp/html/getDatasheet?partID=359321&src-supplier=Verical; ComponentLink3URL: http://www1.futureelectronics.com/doc/SAMSUNG/CL10B104JB8NNNC.pdf?src-supplier=Future+Electronics; ComponentLink3Description: http://www1.futureelectronics.com/doc/SAMSUNG/CL10B104JB8NNNC.pdf?src-supplier=Future+Electronics; ComponentLink4URL: https://produktinfo.conrad.com/datenblaetter/450000-474999/456613-da-01-en-VS_KONDENSATOR_0603.pdf?src-supplier=Conrad; ComponentLink4Description: https://produktinfo.conrad.com/datenblaetter/450000-474999/456613-da-01-en-VS_KONDENSATOR_0603.pdf?src-supplier=Conrad
C4 C5 = Capacitor - Ceramic: Ceramic, SMT Capacitor; Manufacturer: Taiyo Yuden; Manufacturer Part Number: UMK107ABJ474KA-T; Tolerance: 10%; Voltage Rating: 50V; Dielectric: X5R; Supplier 1: Digi-Key; Supplier Part Number 1: 587-3171-1-ND; Stock 1: 299107; Pricing 1: 1 = 0,19000, 10 = 0,13700, 100 = 0,06440, 500 = 0,04516, 1000 = 0,03739 (USD); RoHS: Yes; Mount: Surface Mount; Case/Package: 0603; Case Code (Imperial): 0603; Case Code (Metric): 1608; Min Operating Temperature: -55°C; Max Operating Temperature: 85°C; Packaging: Tape and Reel; Package Quantity: 1; Capacitance: 470nF; Voltage Rating (DC): 50V; Termination: SMD/SMT; Voltage: 50V; Length: 1.6mm; Height: 0.8mm; Width: 0.8mm; Thickness: 0.037inch; Depth: 0.8mm; Radiation Hardening: No; Lead Free: Lead Free; ComponentLink1URL: https://datasheet.ciiva.com/30226/445umk107abj474ka-t-30226784.pdf?src-supplier=Onlinecomponents.com; ComponentLink1Description: https://datasheet.ciiva.com/30226/445umk107abj474ka-t-30226784.pdf?src-supplier=Onlinecomponents.com; ComponentLink2URL: https://datasheet.ciiva.com/6282/umk107abj474ka-t-6282326.pdf?src-supplier=Digi-Key; ComponentLink2Description: https://datasheet.ciiva.com/6282/umk107abj474ka-t-6282326.pdf?src-supplier=Digi-Key; ComponentLink3URL: https://datasheet.ciiva.com/15922/30umk107abj474ka-t-15922603.pdf?src-supplier=Onlinecomponents.com; ComponentLink3Description: https://datasheet.ciiva.com/15922/30umk107abj474ka-t-15922603.pdf?src-supplier=Onlinecomponents.com; ComponentLink4URL: https://datasheet.ciiva.com/11600/umk107abj474ka-t-ss-11600413.pdf?src-supplier=Avnet; ComponentLink4Description: https://datasheet.ciiva.com/11600/umk107abj474ka-t-ss-11600413.pdf?src-supplier=Avnet; ComponentLink5URL: https://datasheet.ciiva.com/6282/umk107abj474ka-t-6282332.pdf?src-supplier=Digi-Key; ComponentLink5Description: https://datasheet.ciiva.com/6282/umk107abj474ka-t-6282332.pdf?src-supplier=Digi-Key
D1-D4 = Diode: as D5 on sheet Outputs; ComponentLink1URL: http://www.smc-diodes.com/propdf/1N4148W%20N0571%20REV.D.pdf?src-supplier=Digi-Key; ComponentLink1Description: http://www.smc-diodes.com/propdf/1N4148W%20N0571%20REV.D.pdf?src-supplier=Digi-Key; Supplier 1: Digi-Key; Supplier Part Number 1: 1655-1360-1-ND; Manufacturer Part Number: 1N4148WTR; Stock 1: 8882; Pricing 1: 1 = 0,12000, 10 = 0,11300, 25 = 0,10720, 100 = 0,04710, 250 = 0,04524, 500 = 0,03702, 1000 = 0,02571 (USD); RoHS: No; Mount: Surface Mount; Packaging: Tape and Reel
IC1 = TI TLA202x: Integrated Circuit; Manufacturer: Texas Instruments; Number of Bits: 12; Sampling Rate: 3300S/s; Number of A/D Converters: 1; Interface: I2C; Number of Inputs: 4; Supplier 1: Digi-Key; Supplier Part Number 1: 296-48346-1-ND; Manufacturer Part Number: TLA2024IRUGT; Stock 1: 5713; Pricing 1: 1 = 1,94000, 10 = 1,74400, 25 = 1,64520, 100 = 1,31600 (USD); RoHS: No; Min Operating Temperature: -40°C; Max Operating Temperature: 85°C; Packaging: Cut Tape; ComponentLink1URL: http://www.ti.com/lit/ds/symlink/tla2022.pdf?src-supplier=Farnell; ComponentLink1Description: http://www.ti.com/lit/ds/symlink/tla2022.pdf?src-supplier=Farnell; ComponentLink2URL: http://www.ti.com/lit/ds/symlink/tla2021.pdf?src-supplier=Digi-Key; ComponentLink2Description: http://www.ti.com/lit/ds/symlink/tla2021.pdf?src-supplier=Digi-Key; ComponentLink3URL: http://www.ti.com/general/docs/suppproductinfo.tsp?distId=10&amp;gotoUrl=http%3A%2F%2Fwww.ti.com%2Flit%2Fgpn%2Ftla2021&src-supplier=Digi-Key; ComponentLink3Description: http://www.ti.com/general/docs/suppproductinfo.tsp?distId=10&amp;gotoUrl=http%3A%2F%2Fwww.ti.com%2Flit%2Fgpn%2Ftla2021&src-supplier=Digi-Key
IC2 = SI LABS SI8602: Manufacturer: Silicon Labs; Min Supply Voltage: 3V; Max Supply Voltage: 5.5V; Number of Channels: 2; Rise Time: 4ns; Data Rate: 1.7Mbps; Propagation Delay: 55ns; Polarity: Bidirectional,Unidirectional; Operating Supply Current: 4.7mA; Max Power Dissipation: 220mW; Channel Type: Bidirectional; Max Input Current: 7.1mA; Isolated Power: No; Supplier 1: Digi-Key; Supplier Part Number 1: 336-2050-5-ND; Manufacturer Part Number: SI8602AC-B-IS; Stock 1: 2420; Pricing 1: 1 = 2,99000, 25 = 2,87920, 100 = 2,76850, 1000 = 2,51989 (USD); RoHS: Yes; Case/Package: SOIC; Number of Pins: 8; Weight: 0.001764oz; Min Operating Temperature: -40°C; Max Operating Temperature: 125°C; Packaging: Rail/Tube; Length: 5mm; Width: 4mm; Depth: 1.55mm; REACH SVHC: Unknown; ComponentLink1URL: http://www.mouser.com/ds/2/368/Si860x-51606.pdf; ComponentLink1Description: http://www.mouser.com/ds/2/368/Si860x-51606.pdf; ComponentLink2URL: https://www.silabs.com/documents/public/data-sheets/Si860x.pdf; ComponentLink2Description: https://www.silabs.com/documents/public/data-sheets/Si860x.pdf
R1 R6 = Resistor_Chip: Ceramic, SMT Capacitor; Manufacturer: Yageo; Manufacturer Part Number: RC0603FR-07100RL; Voltage Rating (DC): 50V; Tolerance: 1%; Temperature Coefficient: 100ppm/°C; Power Rating: 100mW; Supplier 1: Digi-Key; Supplier Part Number 1: 311-100HRDKR-ND; Stock 1: 12121627; Pricing 1: 1 = 0,10000, 10 = 0,02300, 100 = 0,00940, 1000 = 0,00421, 2500 = 0,00366 (USD); RoHS: Yes; Case/Package: 0603; Number of Pins: 2; Case Code (Imperial): 0603; Case Code (Metric): 1608; Min Operating Temperature: -55°C; Max Operating Temperature: 155°C; Resistance: 100R; Packaging: Tape and Reel; Composition: Thick Film; Voltage Rating: 50V; Termination: SMD/SMT; Military Standard: Not; Length: 1.6mm; Height: 0.45mm; Width: 0.8mm; Depth: 0.8mm; REACH SVHC: Unknown; Lead Free: Lead Free; ComponentLink1URL: https://datasheet.ciiva.com/7660/38590-7660788.pdf?src-supplier=Element14; ComponentLink1Description: https://datasheet.ciiva.com/7660/38590-7660788.pdf?src-supplier=Element14; ComponentLink2URL: https://datasheet.ciiva.com/11808/0900766b80f96399-11808280.pdf?src-supplier=RSComponents; ComponentLink2Description: https://datasheet.ciiva.com/11808/0900766b80f96399-11808280.pdf?src-supplier=RSComponents; ComponentLink3URL: https://datasheet.ciiva.com/7746/1738695-7746237.pdf?src-supplier=Element14; ComponentLink3Description: https://datasheet.ciiva.com/7746/1738695-7746237.pdf?src-supplier=Element14; ComponentLink4URL: https://datasheet.ciiva.com/7746/1738695-7746238.pdf?src-supplier=Element14; ComponentLink4Description: https://datasheet.ciiva.com/7746/1738695-7746238.pdf?src-supplier=Element14; ComponentLink5URL: https://datasheet.ciiva.com/22747/443971-22747518.pdf?src-supplier=Element14; ComponentLink5Description: https://datasheet.ciiva.com/22747/443971-22747518.pdf?src-supplier=Element14; ComponentLink6URL: https://datasheet.ciiva.com/46440/1868787-46440890.pdf?src-supplier=Element14; ComponentLink6Description: https://datasheet.ciiva.com/46440/1868787-46440890.pdf?src-supplier=Element14
R2-R5 = Resistor_Chip: Ceramic, SMT Capacitor; Manufacturer: Stackpole Electronics; Manufacturer Part Number: RMCF0603FT1K10; Power Rating: 100mW; Tolerance: 1%; Temperature Coefficient: 100ppm/°C; Supplier 1: Digi-Key; Supplier Part Number 1: RMCF0603FT1K10CT-ND; Stock 1: 27246; Pricing 1: 1 = 0,10000, 10 = 0,01800, 100 = 0,00710, 1000 = 0,00321, 2500 = 0,00278 (USD); RoHS: Yes; Mount: Surface Mount; Case/Package: 0603; Case Code (Metric): 1608; Case Code (Imperial): 0603; Contact Plating: Matte,Tin; Min Operating Temperature: -55°C; Max Operating Temperature: 155°C; Resistance: 1.1kR; Packaging: Tape and Reel; Composition: Thick Film; Number of Terminations: 2; Max Power Dissipation: 100mW; Features: Automotive AEC-Q200; Length: 0.061inch; Height: 0.022inch; Width: 0.031inch; Radiation Hardening: No; Lead Free: Lead Free

## Sheet PT100.SchDoc: Isolated PT100
size A4; Revision: 1; SheetNumber: 6; SheetTotal: 7; SheetSize: A4
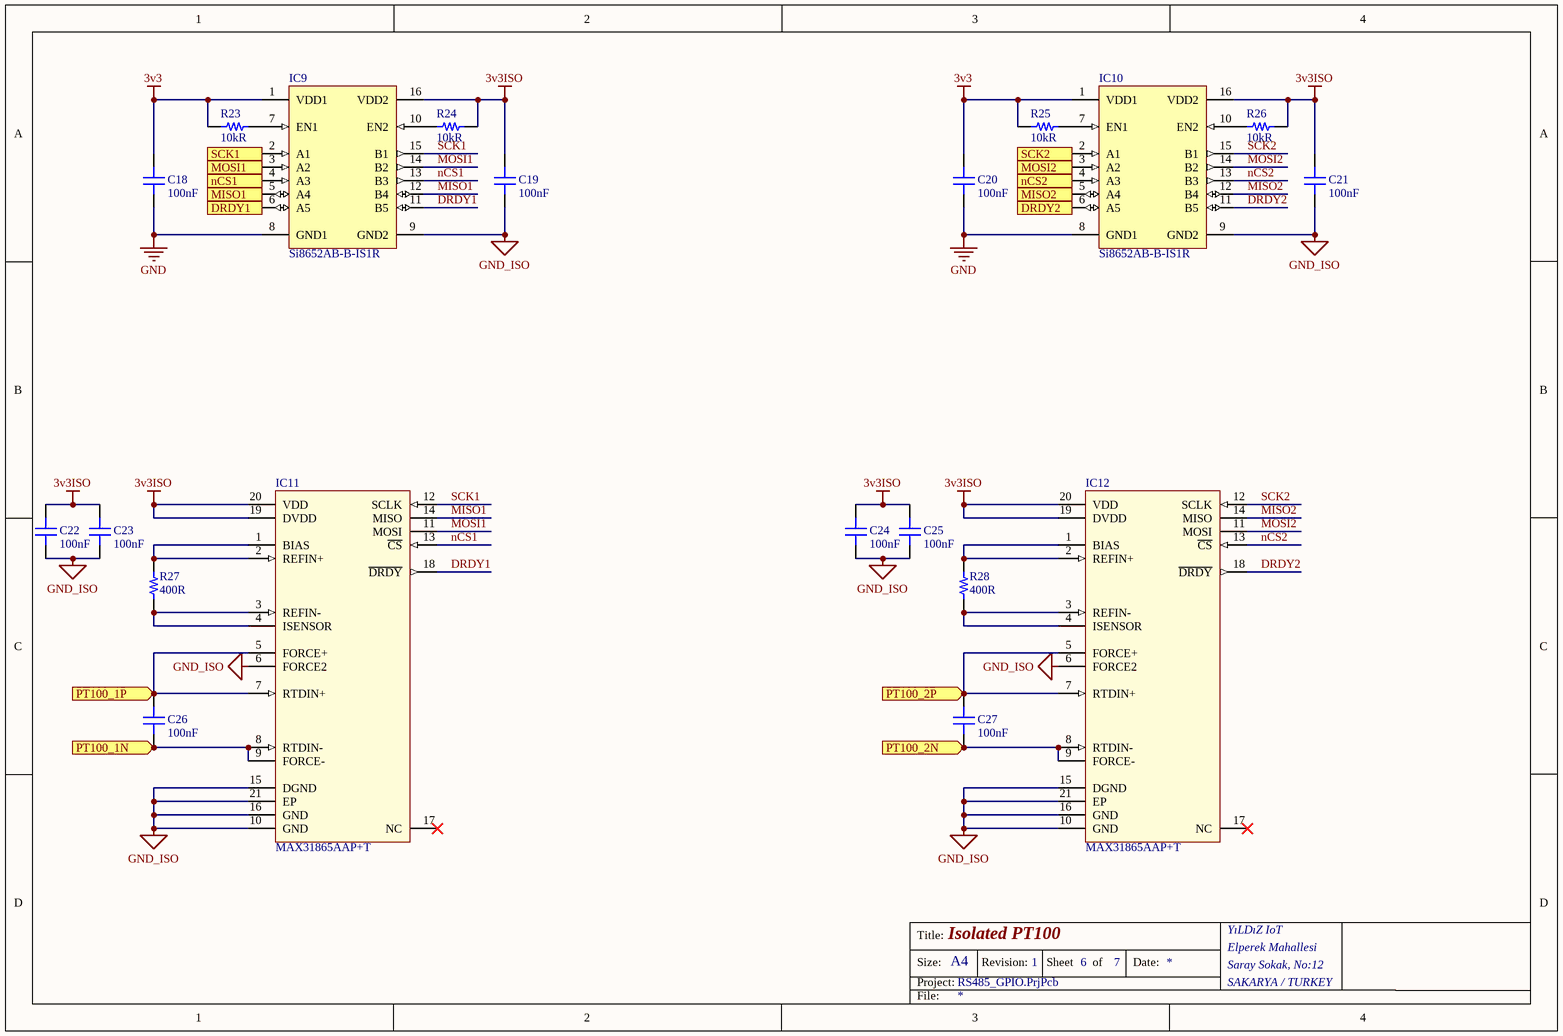
[diagram p3: PT100.SchDoc]

### Parts
C18  100nF  [CAP 0603/1608]
C19  100nF  [CAP 0603/1608]
C20  100nF  [CAP 0603/1608]
C21  100nF  [CAP 0603/1608]
C22  100nF  [CAP 0603/1608]
C23  100nF  [CAP 0603/1608]
C24  100nF  [CAP 0603/1608]
C25  100nF  [CAP 0603/1608]
C26  100nF  [CAP 0603/1608]
C27  100nF  [CAP 0603/1608]
IC9  Si8652AB-B-IS1R  [SI LABS SOIC-16 WIDE]
IC10  Si8652AB-B-IS1R  [SI LABS SOIC-16 WIDE]
IC11  MAX31865AAP+T  [MAXIM QFN-20 5x5mm]
IC12  MAX31865AAP+T  [MAXIM QFN-20 5x5mm]
R23  10kR  [RES 0603/1608]
R24  10kR  [RES 0603/1608]
R25  10kR  [RES 0603/1608]
R26  10kR  [RES 0603/1608]
R27  400R  [RES 0603/1608]
R28  400R  [RES 0603/1608]

### Ports
DRDY1 (out), DRDY2 (out), MISO1 (out), MISO2 (out), MOSI1 (in), MOSI2 (in), nCS1 (in), nCS2 (in), PT100_1N (in), PT100_1P (in), PT100_2N (in), PT100_2P (in), SCK1 (in), SCK2 (in)

### Nets
3v3: C18.2 C20.2 IC9.1(VDD1) IC10.1(VDD1) R23.1 R25.1
3v3ISO: C19.2 C21.2 C22.2 C23.2 C24.2 C25.2 IC9.16(VDD2) IC10.16(VDD2) IC11.19(DVDD) IC11.20(VDD) IC12.19(DVDD) IC12.20(VDD) R24.2 R26.2
GND: C18.1 C20.1 IC9.8(GND1) IC10.8(GND1)
GND_ISO: C19.1 C21.1 C22.1 C23.1 C24.1 C25.1 IC9.9(GND2) IC10.9(GND2) IC11.6(FORCE2) IC11.10(GND) IC11.15(DGND) IC11.16(GND) IC11.21(EP) IC12.6(FORCE2) IC12.10(GND) IC12.15(DGND) IC12.16(GND) IC12.21(EP)
DRDY1: IC9.11(B5) IC11.18(~{DRDY})
DRDY2: IC10.11(B5) IC12.18(~{DRDY})
MISO1: IC9.12(B4) IC11.14(MISO)
MISO2: IC10.12(B4) IC12.14(MISO)
MOSI1: IC9.14(B2) IC11.11(MOSI)
MOSI2: IC10.14(B2) IC12.11(MOSI)
nCS1: IC9.13(B3) IC11.13(~{CS})
nCS2: IC10.13(B3) IC12.13(~{CS})
PT100_1N: C26.1 IC11.8(RTDIN-) IC11.9(FORCE-) ; port PT100_1N
PT100_1P: C26.2 IC11.5(FORCE+) IC11.7(RTDIN+) ; port PT100_1P
PT100_2N: C27.1 IC12.8(RTDIN-) IC12.9(FORCE-) ; port PT100_2N
PT100_2P: C27.2 IC12.5(FORCE+) IC12.7(RTDIN+) ; port PT100_2P
SCK1: IC9.15(B1) IC11.12(SCLK)
SCK2: IC10.15(B1) IC12.12(SCLK)
NetIC9_2: IC9.2(A1) ; port SCK1
NetIC9_3: IC9.3(A2) ; port MOSI1
NetIC9_4: IC9.4(A3) ; port nCS1
NetIC9_5: IC9.5(A4) ; port MISO1
NetIC9_6: IC9.6(A5) ; port DRDY1
NetIC9_7: IC9.7(EN1) R23.2
NetIC9_10: IC9.10(EN2) R24.1
NetIC10_2: IC10.2(A1) ; port SCK2
NetIC10_3: IC10.3(A2) ; port MOSI2
NetIC10_4: IC10.4(A3) ; port nCS2
NetIC10_5: IC10.5(A4) ; port MISO2
NetIC10_6: IC10.6(A5) ; port DRDY2
NetIC10_7: IC10.7(EN1) R25.2
NetIC10_10: IC10.10(EN2) R26.1
NetIC11_1: IC11.1(BIAS) IC11.2(REFIN+) R27.2
NetIC11_3: IC11.3(REFIN-) IC11.4(ISENSOR) R27.1
NetIC12_1: IC12.1(BIAS) IC12.2(REFIN+) R28.2
NetIC12_3: IC12.3(REFIN-) IC12.4(ISENSOR) R28.1

Not connected (* = marked no-connect by the designer): IC11 17(NC)*; IC12 17(NC)*

### Notes on the sheet
- Title:
- Size:
- Project:
- Revision:
- Sheet
- of
- Date:
- YıLDıZ IoT
- Elperek Mahallesi
- Saray Sokak, No:12
- SAKARYA / TURKEY
- File:

### Library data of the parts
C18-C27 = Capacitor - Ceramic: as C6 on sheet Inputs; Supplier 1: Digi-Key; Supplier Part Number 1: 1276-1033-1-ND; Stock 1: 223594; Pricing 1: 1 = 0,10000, 10 = 0,05300, 100 = 0,02350, 500 = 0,01680, 1000 = 0,01320 (USD); RoHS: Yes; Mount: Surface Mount; Case/Package: 0603; Case Code (Metric): 1608; Case Code (Imperial): 0603; Material: Ceramic; Contact Plating: Tin; Min Operating Temperature: -55°C; Max Operating Temperature: 125°C; Packaging: Tape and Reel; Package Quantity: 1; Capacitance: 100nF; Voltage: 50V; Length: 1.6mm; Height: 0.8mm; Width: 0.031inch; Thickness: 0.035inch; Depth: 0.8mm; Radiation Hardening: No; ComponentLink1URL: https://media.digikey.com/pdf/Data%20Sheets/Samsung%20PDFs/CL_Series_MLCC_ds.pdf?src-supplier=Digi-Key; ComponentLink1Description: https://media.digikey.com/pdf/Data%20Sheets/Samsung%20PDFs/CL_Series_MLCC_ds.pdf?src-supplier=Digi-Key; ComponentLink2URL: https://www.verical.com/server-webapp/html/getDatasheet?partID=359321&src-supplier=Verical; ComponentLink2Description: https://www.verical.com/server-webapp/html/getDatasheet?partID=359321&src-supplier=Verical; ComponentLink3URL: http://www1.futureelectronics.com/doc/SAMSUNG/CL10B104JB8NNNC.pdf?src-supplier=Future+Electronics; ComponentLink3Description: http://www1.futureelectronics.com/doc/SAMSUNG/CL10B104JB8NNNC.pdf?src-supplier=Future+Electronics; ComponentLink4URL: https://produktinfo.conrad.com/datenblaetter/450000-474999/456613-da-01-en-VS_KONDENSATOR_0603.pdf?src-supplier=Conrad; ComponentLink4Description: https://produktinfo.conrad.com/datenblaetter/450000-474999/456613-da-01-en-VS_KONDENSATOR_0603.pdf?src-supplier=Conrad
IC9 IC10 = SI LABS SI8652: Manufacturer: Silicon Labs; Propagation Delay: 35ns; Min Supply Voltage: 2.7V; Max Supply Voltage: 5.5V; Max Power Dissipation: 415mW; Number of Channels: 5; Data Rate: 1Mbps; Isolated Power: No; Pulse Width Distortion (PWD): 25ns; Operating Supply Current: 4.1mA; Channel Type: Unidirectional; Supplier 1: Digi-Key; Supplier Part Number 1: 336-5216-1-ND; Manufacturer Part Number: Si8652AB-B-IS1R; Stock 1: 2236; Pricing 1: 1 = 2,10000, 25 = 2,02120, 100 = 1,94360 (USD); RoHS: Yes; Case/Package: SOIC; Number of Pins: 16; Min Operating Temperature: -40°C; Max Operating Temperature: 125°C; Type: General Purpose; Packaging: Tape and Reel; Package Quantity: 2500; ComponentLink1URL: https://datasheet.ciiva.com/29891/si86xx-29891881.pdf?src-supplier=Avnet; ComponentLink1Description: https://datasheet.ciiva.com/29891/si86xx-29891881.pdf?src-supplier=Avnet; ComponentLink2URL: https://datasheet.ciiva.com/29659/si86xx-29659290.pdf?src-supplier=Digi-Key; ComponentLink2Description: https://datasheet.ciiva.com/29659/si86xx-29659290.pdf?src-supplier=Digi-Key
IC11 IC12 = Maxim MAX31865: RTD-to-Digital Converter; Manufacturer: Maxim; Description: IC RTD TO DIGITAL CONVERT 20SSOP; Output Type: SPI; ComponentLink1URL: https://datasheet.ciiva.com/14320/max31865-14320743.pdf?src-supplier=Avnet; ComponentLink1Description: https://datasheet.ciiva.com/14320/max31865-14320743.pdf?src-supplier=Avnet; ComponentLink2URL: https://datasheet.ciiva.com/25893/max31865-25893916.pdf?src-supplier=Avnet+Europe; ComponentLink2Description: https://datasheet.ciiva.com/25893/max31865-25893916.pdf?src-supplier=Avnet+Europe; ComponentLink3URL: https://datasheet.ciiva.com/14083/max31865-14083679.pdf?src-supplier=Digi-Key; ComponentLink3Description: https://datasheet.ciiva.com/14083/max31865-14083679.pdf?src-supplier=Digi-Key; Supplier 1: Digi-Key; Supplier Part Number 1: MAX31865AAP+TCT-ND; Manufacturer Part Number: MAX31865AAP+T; Stock 1: 3767; Pricing 1: 1 = 5,14000, 10 = 4,64400, 25 = 4,42800, 100 = 3,67200, 250 = 3,51000 (USD); RoHS: Yes; Mount: Surface Mount; Case/Package: SSOP; Min Operating Temperature: -40°C; Max Operating Temperature: 125°C; Packaging: Tape and Reel; ComponentLink4URL: https://media.digikey.com/pdf/Data%20Sheets/Maxim%20PDFs/PartNumberBreakdown_ds.pdf?src-supplier=Digi-Key; ComponentLink4Description: https://media.digikey.com/pdf/Data%20Sheets/Maxim%20PDFs/PartNumberBreakdown_ds.pdf?src-supplier=Digi-Key; ComponentLink5URL: http://www.farnell.com/datasheets/2345101.pdf?src-supplier=Farnell; ComponentLink5Description: http://www.farnell.com/datasheets/2345101.pdf?src-supplier=Farnell; ComponentLink6URL: http://www.mouser.com/ds/2/256/MAX31865-775735.pdf?src-supplier=Mouser; ComponentLink6Description: http://www.mouser.com/ds/2/256/MAX31865-775735.pdf?src-supplier=Mouser; ComponentLink7URL: https://datasheets.maximintegrated.com/en/ds/MAX31865.pdf?src-supplier=Digi-Key; ComponentLink7Description: https://datasheets.maximintegrated.com/en/ds/MAX31865.pdf?src-supplier=Digi-Key
R23-R26 = Resistor_Chip: as R7 on sheet Inputs; Supplier 1: Digi-Key; Supplier Part Number 1: RNCP0603FTD10K0CT-ND; Stock 1: 183083; Pricing 1: 1 = 0,10000, 10 = 0,06700, 100 = 0,02730, 1000 = 0,01224, 2500 = 0,01063 (USD); RoHS: Yes; Mount: Surface Mount; Case/Package: 0603; Case Code (Metric): 1608; Case Code (Imperial): 0603; Contact Plating: Matte,Tin; Min Operating Temperature: -55°C; Max Operating Temperature: 155°C; Packaging: Tape and Reel; Resistance: 10kR; Composition: Thin Film; Number of Terminations: 2; Features: Anti-Sulfur,Moisture Resistant; Length: 0.059inch; Height: 0.02inch; Width: 0.031inch; Radiation Hardening: No; Lead Free: Lead Free
R27 R28 = Resistor_Chip: Ceramic, SMT Capacitor; Manufacturer: Vishay Dale Thin Film; Manufacturer Part Number: PAT0603E4000BST1; Power Rating: 150mW; Tolerance: 0.1%; Voltage Rating: 75V; Temperature Coefficient: 25ppm/°C; Supplier 1: Digi-Key; Supplier Part Number 1: PAT400ACT-ND; Stock 1: 20512; Pricing 1: 1 = 0,92000, 10 = 0,79900, 100 = 0,55660 (USD); RoHS: Yes; Case/Package: 0603; Case Code (Imperial): 0603; Case Code (Metric): 1608; Min Operating Temperature: -55°C; Max Operating Temperature: 155°C; Features: Moisture Resistant,Automotive AEC-Q200,Anti-Sulfur; Resistance: 400R; Packaging: Tape and Reel; Package Quantity: 1; Max Power Dissipation: 150mW; Termination: SMD/SMT; Composition: Thin Film; Number of Terminations: 2; Military Standard: Not; Length: 0.064inch; Height: 0.018inch; Width: 0.762mm; Depth: 0.81mm; ComponentLink1URL: https://datasheet.ciiva.com/2529/pat-2529079.pdf?src-supplier=Digi-Key; ComponentLink1Description: https://datasheet.ciiva.com/2529/pat-2529079.pdf?src-supplier=Digi-Key; ComponentLink2URL: https://datasheet.ciiva.com/2529/pat-2529080.pdf?src-supplier=Digi-Key; ComponentLink2Description: https://datasheet.ciiva.com/2529/pat-2529080.pdf?src-supplier=Digi-Key; ComponentLink3URL: https://datasheet.ciiva.com/2529/pat-2529081.pdf?src-supplier=Digi-Key; ComponentLink3Description: https://datasheet.ciiva.com/2529/pat-2529081.pdf?src-supplier=Digi-Key